# EAGLE design VSSOP-10 Breakout Board (EAGLE 8.4.1)
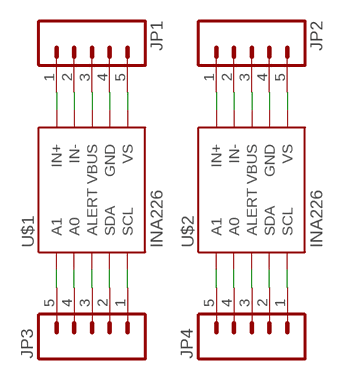
[diagram p0: schematic, sheet 1]

## Parts
JP1  M05  [1X05]
JP2  M05  [1X05]
JP3  M05  [1X05]
JP4  M05  [1X05]
U$1  INA226  [VSSOP-10]
U$2  INA226  [VSSOP-10]

## Nets
N$1: JP4.1 U$2.5(SCL)
N$2: JP4.2 U$2.4(SDA)
N$3: JP4.3 U$2.3(ALERT)
N$4: JP4.4 U$2.2(A0)
N$5: JP4.5 U$2.1(A1)
N$6: JP3.1 U$1.5(SCL)
N$7: JP3.2 U$1.4(SDA)
N$8: JP3.3 U$1.3(ALERT)
N$9: JP3.4 U$1.2(A0)
N$10: JP3.5 U$1.1(A1)
N$11: JP2.1 U$2.10(IN+)
N$12: JP2.2 U$2.9(IN-)
N$13: JP2.3 U$2.8(VBUS)
N$14: JP2.4 U$2.7(GND)
N$15: JP2.5 U$2.6(VS)
N$16: JP1.1 U$1.10(IN+)
N$17: JP1.2 U$1.9(IN-)
N$18: JP1.3 U$1.8(VBUS)
N$19: JP1.4 U$1.7(GND)
N$20: JP1.5 U$1.6(VS)

## Library data of the parts
JP1-JP4 = HyTechDevices:M05: Standard 5-pin 0.1" header. NOTES ON THE VARIANTS LOCK and LOCK_LONGPADS... This footprint was designed to help hold the alignment of a through-hole component (i.e. 5-pin header) while soldering it into place. You may notice that each hole has been shifted either up or down by 0.005 of an inch from it's more standard position (which is a perfectly straight line). This slight alteration caused the pins (the squares in the middle) to touch the edges of the holes. Because they are alternating, it causes a "brace" to hold the component in place. 0.005 has proven to be the perfect amount of "off-center" position when using our standard breakaway headers. Although looks a little odd when you look at the bare footprint, once you have a header in there, the alteration is very hard to notice. Also,if you push a header all the way into place, it is covered up entirely on the bottom side. This idea of altering the position of holes to aid alignment will be further integrated into the Sparkfun Library for other footprints. It can help hold any component with 3 or more connection pins. Note: The Sparkfun version includes many other packages including surface mount that may be of future interest. Source: Sparkfun <https://github.com/sparkfun/SparkFun-Eagle-Libraries>
U$1 U$2 = HyTechDevices:INA226: INA226 Current and Power Monitor with I2C Compatible Interface

## Board
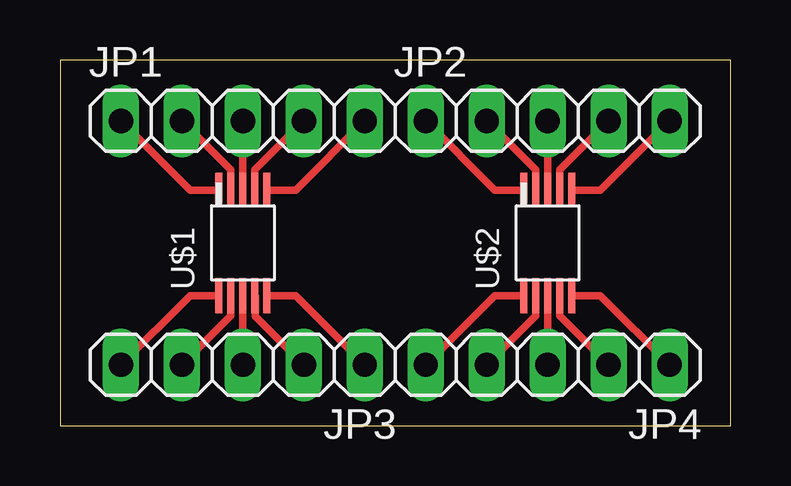
[diagram p1: board, top side]

Size 27.94 x 15.24 mm. Coordinates in mm from the lower left corner, seen from the top.
Outline: 0,0 27.94,0 27.94,15.24 0,15.24 0,0
Copper layers (1*16): Top 0.035mm / dielectric 1.5mm / Bottom 0.035mm
Design rules "DRC Advanced Circuits": minimum track width 6mil, minimum drill 15mil, track to track 6mil, track to pad 6mil, pad to pad 6mil, via to via 6mil, smd to smd 6mil, copper to edge 40mil, drill to drill 6mil, minimum pad ring 10mil, minimum via ring 8mil, stop-mask expansion 4mil, vias tented up to drill 0mil, thermal gap 10mil

### Footprints (pad centres in the part's own frame; a part is rotated, then mirrored left to right if it is on the bottom)
1X05 = drill 1.016 long: 1 -5.08,0; 2 -2.54,0; 3 0,0; 4 2.54,0; 5 5.08,0
VSSOP-10 = smd 0.3 x 1.45: 1 -1,-2.2; 2 -0.5,-2.2; 3 0,-2.2; 4 0.5,-2.2; 5 1,-2.2; 6 1,2.2; 7 0.5,2.2; 8 0,2.2; 9 -0.5,2.2; 10 -1,2.2

### Placement (x,y rotation side)
JP1  7.62,12.7 0 top
JP2  20.32,12.7 0 top
JP3  7.62,2.54 180 top
JP4  20.32,2.54 180 top
U$1  7.62,7.62 0 top
U$2  20.32,7.62 0 top

### Tracks (layer width: path | path; a pad name or v marks a point on that pad's centre or on a via)
N$1
  Top 0.305: JP4.1 22.52,5.42 U$2.5
N$2
  Top 0.305: JP4.2 20.82,4.58 U$2.4
N$3
  Top 0.305: JP4.3 U$2.3
N$4
  Top 0.305: JP4.4 19.82,4.58 U$2.2
N$5
  Top 0.305: JP4.5 18.12,5.42 U$2.1
N$6
  Top 0.305: U$1.5 9.82,5.42 JP3.1
N$7
  Top 0.305: U$1.4 8.13,4.57 JP3.2
N$8
  Top 0.305: U$1.3 JP3.3
N$9
  Top 0.305: U$1.2 7.12,4.58 JP3.4
N$10
  Top 0.305: U$1.1 5.42,5.42 JP3.5
N$11
  Top 0.305: U$2.10 18.12,9.82 JP2.1
N$12
  Top 0.305: U$2.9 19.82,10.66 JP2.2
N$13
  Top 0.305: U$2.8 JP2.3
N$14
  Top 0.305: U$2.7 20.82,10.66 JP2.4
N$15
  Top 0.305: U$2.6 22.52,9.82 JP2.5
N$16
  Top 0.305: U$1.10 5.42,9.82 JP1.1
N$17
  Top 0.305: JP1.2 7.11,10.67 U$1.9
N$18
  Top 0.305: JP1.3 U$1.8
N$19
  Top 0.305: U$1.7 8.12,10.66 JP1.4
N$20
  Top 0.305: U$1.6 9.82,9.82 JP1.5

### Text on the board
tDocu: HyTech Racing | VSSOP-10